# EAGLE design Adapter-RJ45-SignalHead (EAGLE 7.7.0)
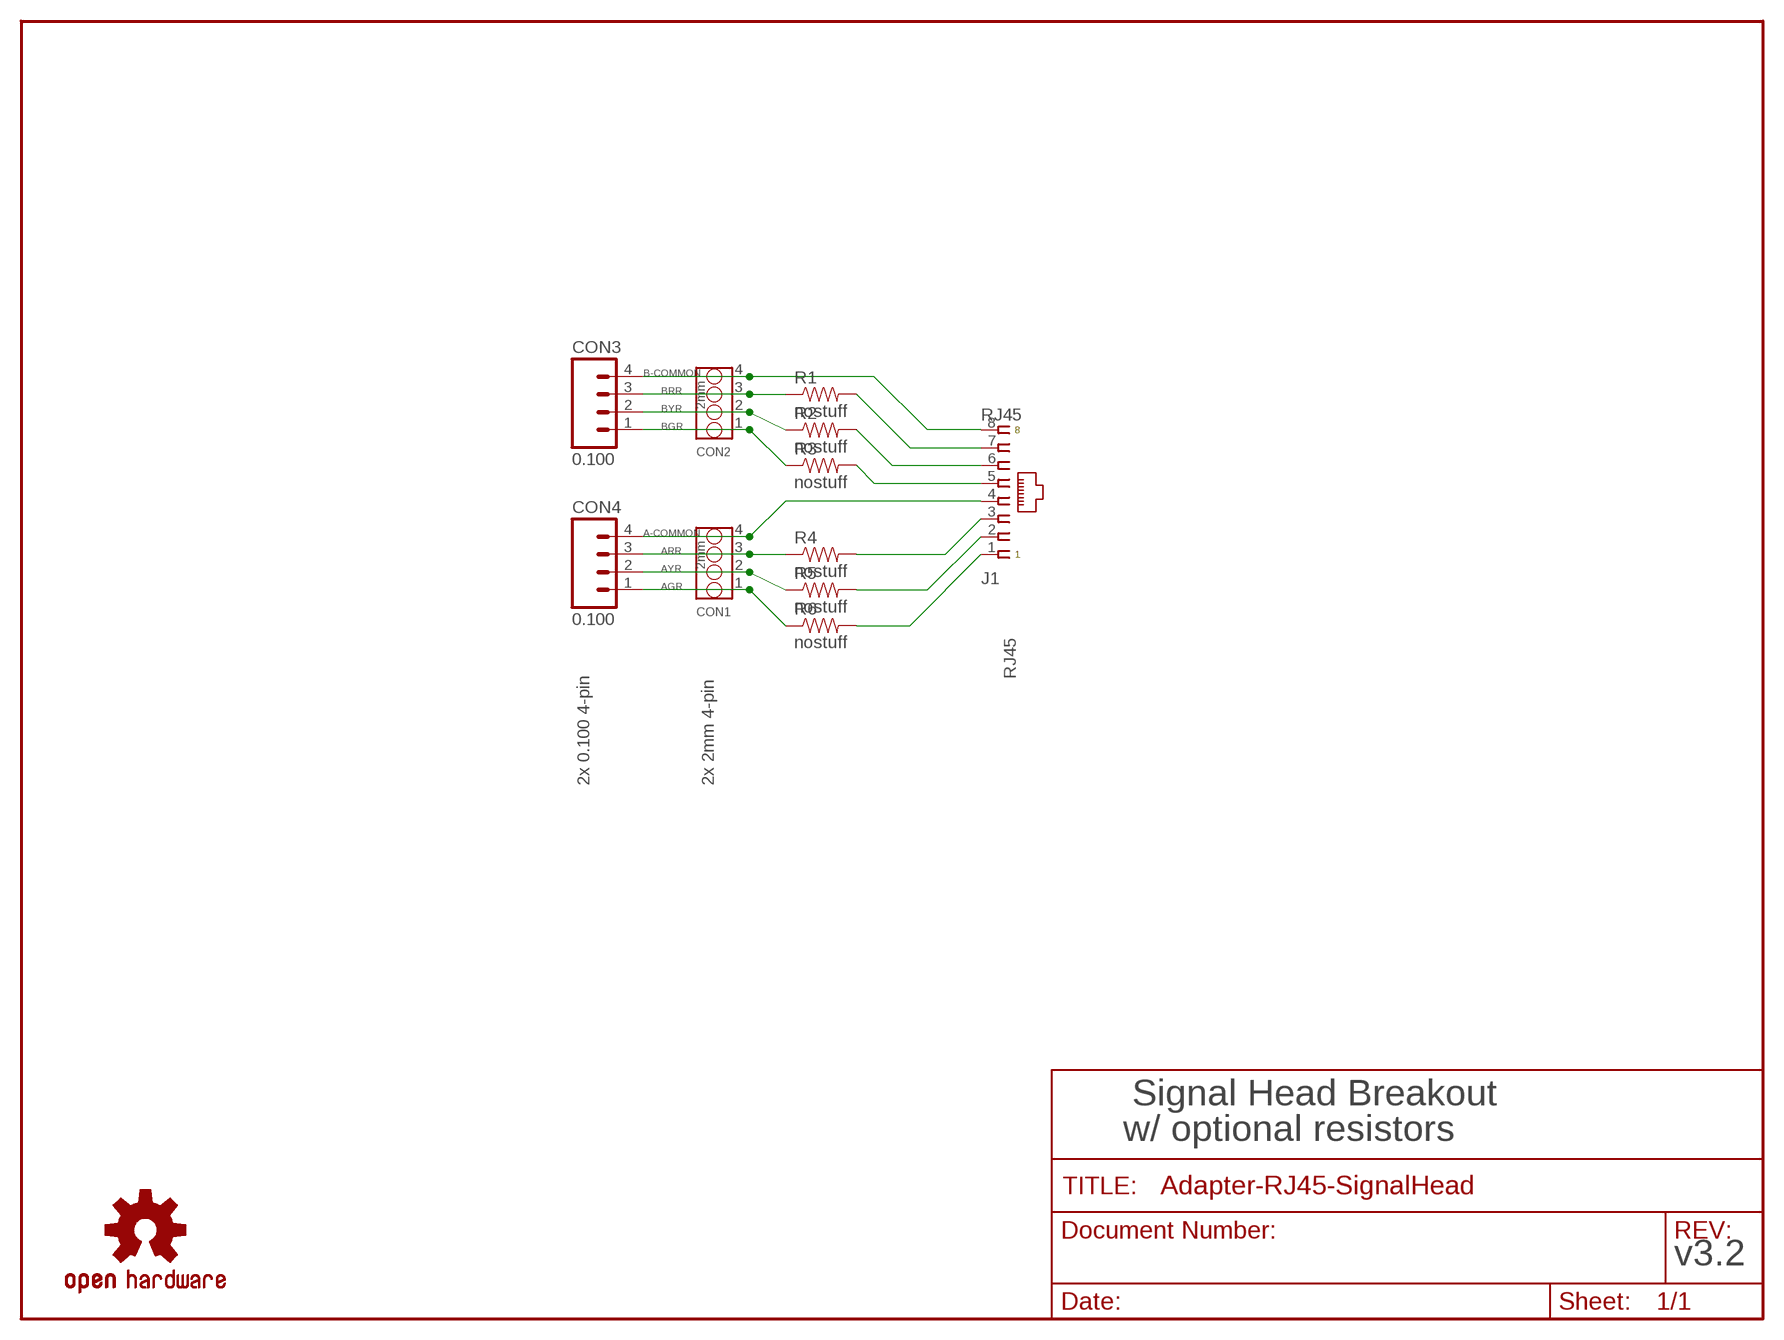
[diagram p0: schematic, sheet 1]

## Parts
CON1  2mm  CONNECTOR-GROVE-4P-2.0-3470130P1  [4P-2.0]
CON2  2mm  CONNECTOR-GROVE-4P-2.0-3470130P1  [4P-2.0]
CON3  0.100  CONNECTOR-M04LOCK  [1X04_LOCK]
CON4  0.100  CONNECTOR-M04LOCK  [1X04_LOCK]
J1  RJ45  CONNECTOR-RJ45-FRONT  [RJ45-NO-SHIELD]
R1  nostuff  RPTH-R0  [CUT-R]
R2  nostuff  RPTH-R0  [CUT-R]
R3  nostuff  RPTH-R0  [CUT-R]
R4  nostuff  RPTH-R0  [CUT-R]
R5  nostuff  RPTH-R0  [CUT-R]
R6  nostuff  RPTH-R0  [CUT-R]
U$1  OSHW  DOC-OSHW-LOGO-M  [OSHW-LOGO-M]

## Nets
A-COMMON: CON1.4 CON4.4 J1.4
AG: J1.1 R6.P1
AGR: CON1.1 CON4.1 R6.P2
AR: J1.3 R4.P1
ARR: CON1.3 CON4.3 R4.P2
AY: J1.2 R5.P1
AYR: CON1.2 CON4.2 R5.P2
B-COMMON: CON2.4 CON3.4 J1.8
BG: J1.5 R3.P1
BGR: CON2.1 CON3.1 R3.P2
BR: J1.7 R1.P1
BRR: CON2.3 CON3.3 R1.P2
BY: J1.6 R2.P1
BYR: CON2.2 CON3.2 R2.P2

## Notes on the sheet
- RJ45
- 2x 0.100 4-pin | 2x 2mm 4-pin
- Signal Head Breakout
- w/ optional resistors
- v3.2

## Library data of the parts
CON1 CON2 = SPCoast:CONNECTOR-GROVE-4P-2.0
CON3 CON4 = SPCoast:CONNECTOR-M04: Header 4 Standard 4-pin 0.1" header. Use with straight break away headers (SKU : PRT-00116), right angle break away headers (PRT-00553), swiss pins (PRT-00743), machine pins (PRT-00117), and female headers (PRT-00115). Molex polarized connector foot print use with SKU : PRT-08231 with associated crimp pins and housings. 1MM SMD Version SKU: PRT-10208
J1 = SPCoast:CONNECTOR-RJ45: Tyco CORCOM Modular RJ Jacks No Shield; AMP: 520151-4; OPL: none
R1-R6 = SPCoast:R*: Resistor Basic schematic elements and footprints for 0603, 1206, and PTH 1/10th watt (small) resistors.
U$1 = SPCoast:DOC-OSHW-LOGO-: Open Source Hardware Logo This logo indicates the piece of hardware it is found on incorporates a OSHW license and/or adheres to the definition of open source hardware http://freedomdefined.org/OSHW Creative Commons - Attribution - ShareAlike 3.0

## Net classes
0 default: width 0.508 mm

## Board
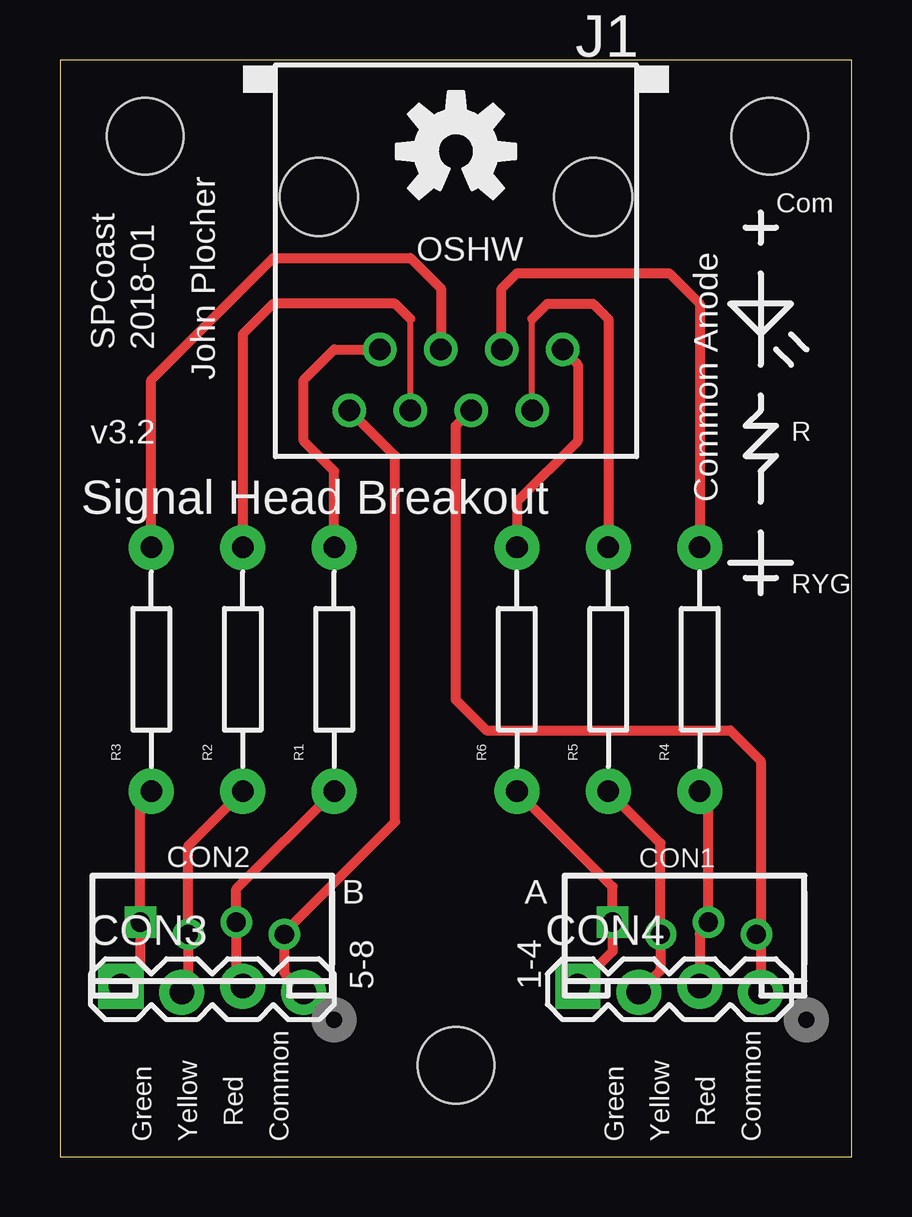
[diagram p1: board, top side]
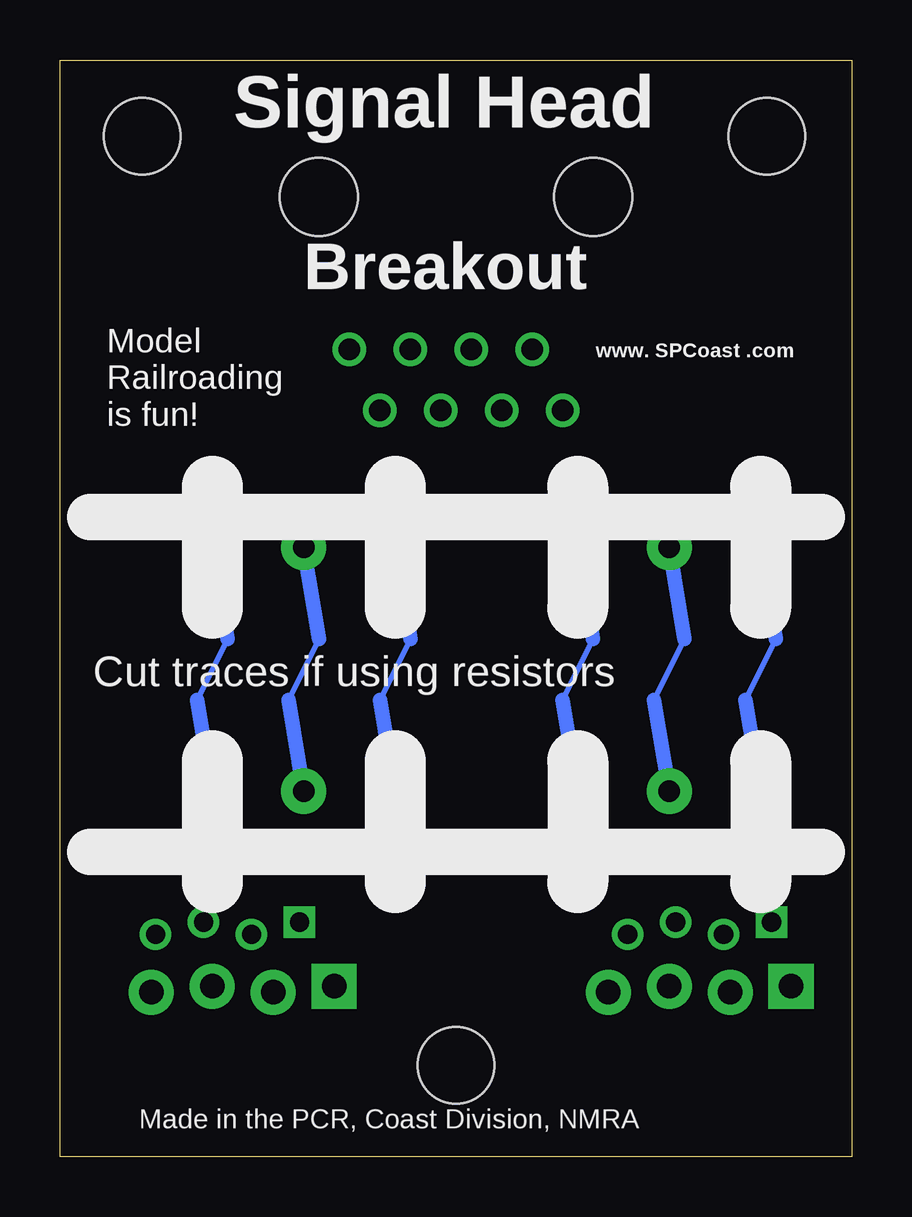
[diagram p2: board, bottom side, seen from below]

Size 33.02 x 45.72 mm. Coordinates in mm from the lower left corner, seen from the top.
Outline: 0,0 33.02,0 33.02,45.72 0,45.72 0,0
Copper layers (1*16): Top 0.035mm / dielectric 1.5mm / Bottom 0.035mm
Design rules "Fusion_eagle_rule_v1.1": minimum track width 6mil, minimum drill 12mil, track to track 6mil, track to pad 6mil, pad to pad 6mil, via to via 6mil, smd to smd 0mil, copper to edge 10mil, drill to drill 10mil, minimum pad ring 10mil, minimum via ring 6mil, stop-mask expansion 2mil, vias tented up to drill 100mil, thermal gap 10mil
Holes 3.2 mm at 3.56,42.55 29.59,42.55 16.51,3.81

### Footprints (pad centres in the part's own frame; a part is rotated, then mirrored left to right if it is on the bottom)
4P-2.0 = drill 0.8 pad 1.27 square: 1 -3,0.254 | drill 0.8 pad 1.27: 2 -1,-0.254; 3 1,0.254; 4 3,-0.254
1X04_LOCK = drill 1.016 pad 1.88 square: 1 0,0.127 | drill 1.016 pad 1.88: 2 2.54,-0.127; 3 5.08,0.127; 4 7.62,-0.127
RJ45-NO-SHIELD = drill 0.9 pad 1.4: 1 -4.445,6.35; 2 -3.175,8.89; 3 -1.905,6.35; 4 -0.635,8.89; 5 0.635,6.35; 6 1.905,8.89; 7 3.175,6.35; 8 4.445,8.89 | hole 3.251: -5.715,0; 5.715,0
CUT-R = drill 0.9 pad 1.88: P1 5.08,0; P2 -5.08,0

### Placement (x,y rotation side)
CON1  26.04,9.53 0 top
CON2  6.35,9.53 0 top
CON3  2.54,6.99 0 top
CON4  21.59,6.99 0 top
J1  16.51,40.01 180 top
R1  11.43,20.32 90 top
R2  7.62,20.32 90 top
R3  3.81,20.32 90 top
R4  26.67,20.32 90 top
R5  22.86,20.32 90 top
R6  19.05,20.32 90 top
U$1  16.51,41.91 0 top

### Tracks (layer width: path | path; a pad name or v marks a point on that pad's centre or on a via)
A-COMMON
  Top 0.406: J1.4 16.51,30.48 16.51,19.05 17.78,17.78 27.94,17.78 29.21,16.51 29.21,9.45 CON1.4 29.21,9.22 CON4.4
AG
  Top 0.406: J1.1 21.59,33.02 21.59,29.84 19.05,27.3 R6.P1
AGR
  Top 0.406: R6.P2 23.04,11.26 CON1.1 23.04,8.56 CON4.1
AR
  Top 0.406: J1.3 18.41,36.2 19.05,36.83 25.4,36.83 26.67,35.56 R4.P1
ARR
  Top 0.406: R4.P2 27.04,14.88 CON1.3 26.67,9.29 CON4.3
AY
  Top 0.254: J1.2 19.68,34.92
  Top 0.406: 19.68,34.92 20.32,35.56 22.23,35.56 22.86,34.92 R5.P1
AYR
  Top 0.406: R5.P2 25.04,13.06 CON1.2 25.04,7.76 CON4.2
B-COMMON
  Top 0.406: J1.8 13.97,29.21 13.97,13.97 9.4,9.4 CON2.4 9.35,7.67 CON3.4
BG
  Top 0.406: R3.P1 3.81,32.38 8.89,37.47 14.61,37.47 15.88,36.2 J1.5
BGR
  Top 0.406: R3.P2 3.35,14.78 CON2.1 3.35,7.92 CON3.1
BR
  Top 0.406: R1.P1 11.43,28.57 10.16,29.84 10.16,32.38 11.43,33.66 J1.7
BRR
  Top 0.406: R1.P2 7.35,11.16 CON2.3 7.35,7.38 CON3.3
BY
  Top 0.254: J1.6 14.61,34.92
  Top 0.406: 14.61,34.92 13.97,35.56 8.89,35.56 7.62,34.29 R2.P1
BYR
  Top 0.406: R2.P2 5.35,12.97 CON2.2 5.35,7.13 CON3.2

### Text on the board
tPlace: Com | OSHW | SPCoast | 2018-01 | John Plocher | v3.2 | R | Signal Head Breakout | Common Anode | RYG | B | A | 5-8 | 1-4 | Green | Yellow | Red | Common | Green | Yellow | Red | Common
bPlace: Signal Head | Breakout | www. SPCoast .com | Model / Railroading / is fun! | Cut traces if using resistors | Made in the PCR, Coast Division, NMRA
_tNames: R3 | R2 | R1 | R6 | R5 | R4 | CON2 | CON1